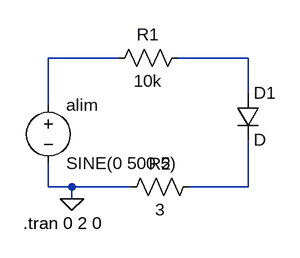
[diagram p0: schematic alternatif.asc]
alternatif.asc, the LTspice schematic file:
Version 4
SHEET 1 880 680
WIRE 112 80 16 80
WIRE 288 80 192 80
WIRE 288 128 288 80
WIRE 16 144 16 80
WIRE 16 256 16 224
WIRE 48 256 16 256
WIRE 128 256 48 256
WIRE 288 256 288 192
WIRE 288 256 208 256
WIRE 48 272 48 256
FLAG 48 272 0
SYMBOL voltage 16 128 R0
WINDOW 123 0 0 Left 0
WINDOW 39 0 0 Left 0
SYMATTR InstName alim
SYMATTR Value SINE(0 500 5)
SYMBOL res 208 64 R90
WINDOW 0 0 56 VBottom 2
WINDOW 3 32 56 VTop 2
SYMATTR InstName R1
SYMATTR Value 10k
SYMBOL diode 272 128 R0
SYMATTR InstName D1
SYMBOL res 224 240 R90
WINDOW 0 0 56 VBottom 2
WINDOW 3 32 56 VTop 2
SYMATTR InstName R2
SYMATTR Value 3
TEXT -18 306 Left 2 !.tran 0 2 0

The netlist it stands for:
* alternatif.asc
V§alim N001 0 SINE(0 500 5)
R1 N002 N001 10k
D1 N002 N003 D
R2 N003 0 3
.model D D
.lib standard.dio
.tran 0 2 0
.backanno
.end